# Altium schematic sheet [16]-DDR2_Power_Supply.SchDoc
size A4
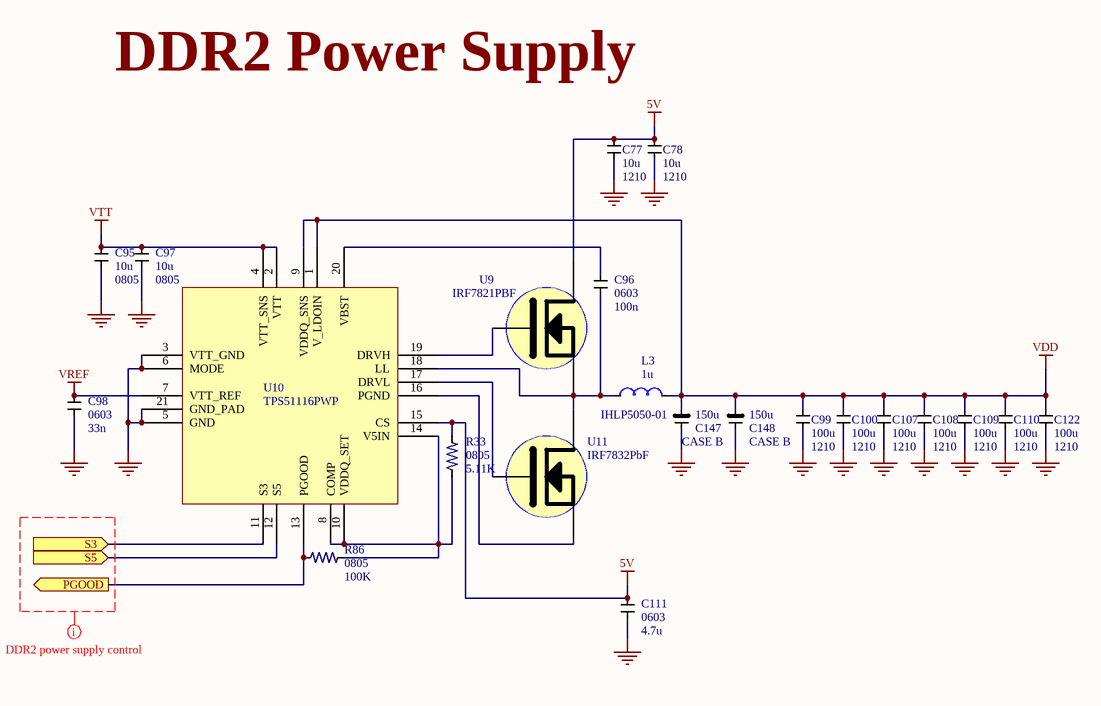
[diagram p0: [16]-DDR2_Power_Supply.SchDoc]

## Parts
C77  10u  PCB package type: 1210  [CAPC3225X28N]
C78  10u  PCB package type: 1210  [CAPC3225X28N]
C95  10u  PCB Package: 0805  [*CAPC2013X140N]
C96  100n  PCB Layer:: 0603  [*0603]
C97  10u  PCB Package: 0805  [*CAPC2013X140N]
C98  33n  PCB Layer:: 0603  [*0603]
C99  100u  PCB package type: 1210  [CAPC3225X28N]
C100  100u  PCB package type: 1210  [CAPC3225X28N]
C107  100u  PCB package type: 1210  [CAPC3225X28N]
C108  100u  PCB package type: 1210  [CAPC3225X28N]
C109  100u  PCB package type: 1210  [CAPC3225X28N]
C110  100u  PCB package type: 1210  [CAPC3225X28N]
C111  4.7u  PCB Layer:: 0603  [*0603]
C122  100u  PCB package type: 1210  [CAPC3225X28N]
C147  150u  CASE: CASE B  [CAPC3529X21N]
C148  150u  CASE: CASE B  [CAPC3529X21N]
L3  1u  [Inductor]
R33  5.11K  PCB footprint: 0805  [*RESC2012X60]
R86  100K  PCB footprint: 0805  [*RESC2012X60]
U9  IRF7821PBF  [SOIC127P600X175-8N]
U10  TPS51116PWP  [SOP65P640X120-21N]
U11  IRF7832PbF  [SOIC127P600X172-8N]

## Ports
PGOOD (out), S3 (in), S5 (in)

## Nets
5V: C77.2 C78.2 C111.2 R33.2 U9.1,2,3(S) U10.15(CS)
GND: C77.1 C78.1 C95.1 C97.1 C98.1 C99.1 C100.1 C107.1 C108.1 C109.1 C110.1 C111.1 C122.1 C147.2 C148.2 U10.3(VTT_GND) U10.5(GND) U10.6(MODE) U10.21(GND_PAD)
VDD: C99.2 C100.2 C107.2 C108.2 C109.2 C110.2 C122.2 C147.1 C148.1 L3.2 U10.1(V_LDOIN) U10.9(VDDQ_SNS)
VREF: C98.2 U10.7(VTT_REF)
VTT: C95.2 C97.2 U10.2(VTT) U10.4(VTT_SNS)
PGOOD: R86.1 U10.13(PGOOD) ; port PGOOD
S3: U10.11(S3) ; port S3
S5: U10.12(S5) ; port S5
NetC96_1: C96.1 L3.1 U9.8,7,6,5(D) U10.18(LL) U11.1,2,3(S)
NetC96_2: C96.2 U10.20(VBST)
NetR33_1: R33.1 R86.2 U10.8(COMP) U10.10(VDDQ_SET) U10.14(V5IN)
NetU9_4: U9.4(G) U10.19(DRVH)
NetU10_16: U10.16(PGND) U11.8,7,6,5(D)
NetU10_17: U10.17(DRVL) U11.4(G)

## Layout directives
net class Undefined: (no net found under the mark)

## Notes on the sheet
- DDR2 Power Supply
- (in symbol Component_1) IHLP5050-01

## Library data of the parts
C77 C78 C95-C100 C107-C111 C122 C147 C148 L3 = Component_1
  C95 C97: Buying URL:: https://uk.farnell.com/avx/08053d475kat2a/cap-4-7-f-25v-10-x5r-0805/dp/1657932?st=4.7u%200805
  C96 C98 C111: Buying URL:: https://uk.farnell.com/avx/0603yc105kat2a/cap-1-f-16v-10-x7r-0603/dp/1658870RL?st=1u%200603
  C147 C148: Buying URL:: https://uk.farnell.com/panasonic-electronic-components/4tpe150mazb/cap-150-f-4v-20/dp/2354853?st=4TPC150M#
  L3: Buying URL:: https://www.mouser.co.uk/ProductDetail/Coilcraft/XFL4015-471MEC?qs=zCSbvcPd3pYzCOJSVbeMnw==
R33 R86 = RP73D1J76R8BTDG: Res Thin Film 0603 76.8 Ohm 0.1% 1/10W Â±15ppm/Â°C Molded SMD Paper T/R; Buying URL:: https://uk.farnell.com/yageo/rc0402fr-07100rl/res-100r-1-0-0625w-0402-thick/dp/9239111
U9 = Component_1: MOSFET Transistor, N Channel, 13.6 A, 30 V, 0.0091 ohm, 10 V, 1 V. Used with TPS51116.; Manufacturer: INFINEON; Designer: Faheem; Company: PhasePhotonics; Data Sheet URL: https://www.infineon.com/dgdl/irf7821pbf.pdf?fileId=5546d462533600a401535608d7f31d06; Buyer URL: https://uk.farnell.com/infineon/irf7821pbf/mosfet-n-logic-so-8/dp/1013495?ost=IRF7821PBF&ddkey=https%3Aen-GB%2FElement14_United_Kingdom%2Fsearch; Manufacturer Part No: IRF7821PBF
U10 = TPS51116PWP: DC to DC Controller Single Output Synchronous Buck 3 Volt to 28 Volt Input 20-Pin HTSSOP EP; Manufacturer: Texas Instruments; Designer: Faheem; Company: PhasePhotonics; Data Sheet: http://www.produktinfo.conrad.com/datenblaetter/1000000-1099999/001014812-da-01-en-IC_SYNC_BUCK_C_TPS51116PWPR_TSSOP_20_TID.pdf; SnapEDA_Link: https://www.snapeda.com/parts/TPS51116PWP/Texas%20Instruments/view-part/?ref=snap; Package: HTSSOP-20 Texas Instruments; Part Number: TPS51116PWP; Digi-Key_Purchase_URL: https://www.digikey.co.uk/product-detail/en/texas-instruments/TPS51116PWP/296-17243-ND/675984?utm_source=snapeda&utm_medium=aggregator&utm_campaign=symbol; Digi-Key_Part_Number: 296-17243-ND
U11 = Component_1: IRF7832TRPBF -  MOSFET Transistor, N Channel, 20 A, 30 V, 0.0031 ohm, 10 V, 2.32 V. Used with TPS51116.; Manufacturer: INFINEON; Designer: Faheem; Company: PhasePhotonics; Data Sheet URL: http://www.farnell.com/datasheets/107881.pdf?_ga=2.7827060.752270131.1548443175-886242363.1545409715&_gac=1.221262314.1547824021.Cj0KCQiAj4biBRC-ARIsAA4WaFgEVxY1DDQMjPmwclte-08yP6TbUPRUf-iJ2mTW08_wstvQJToLRRUaArGKEALw_wcB; Buyer URL: https://uk.farnell.com/infineon/irf7832trpbf/mosfet-n-ch-30v-20a-soic-8/dp/2468025?st=IRF7832; Manufacturer Part No: IRF7832TRPBF